# EAGLE design buckler (EAGLE 9.5.2)
AUTHOR: Branden Ghena; REV: B; TITLE: Berkeley Buckler

## Sheet 1 of 3: Headers
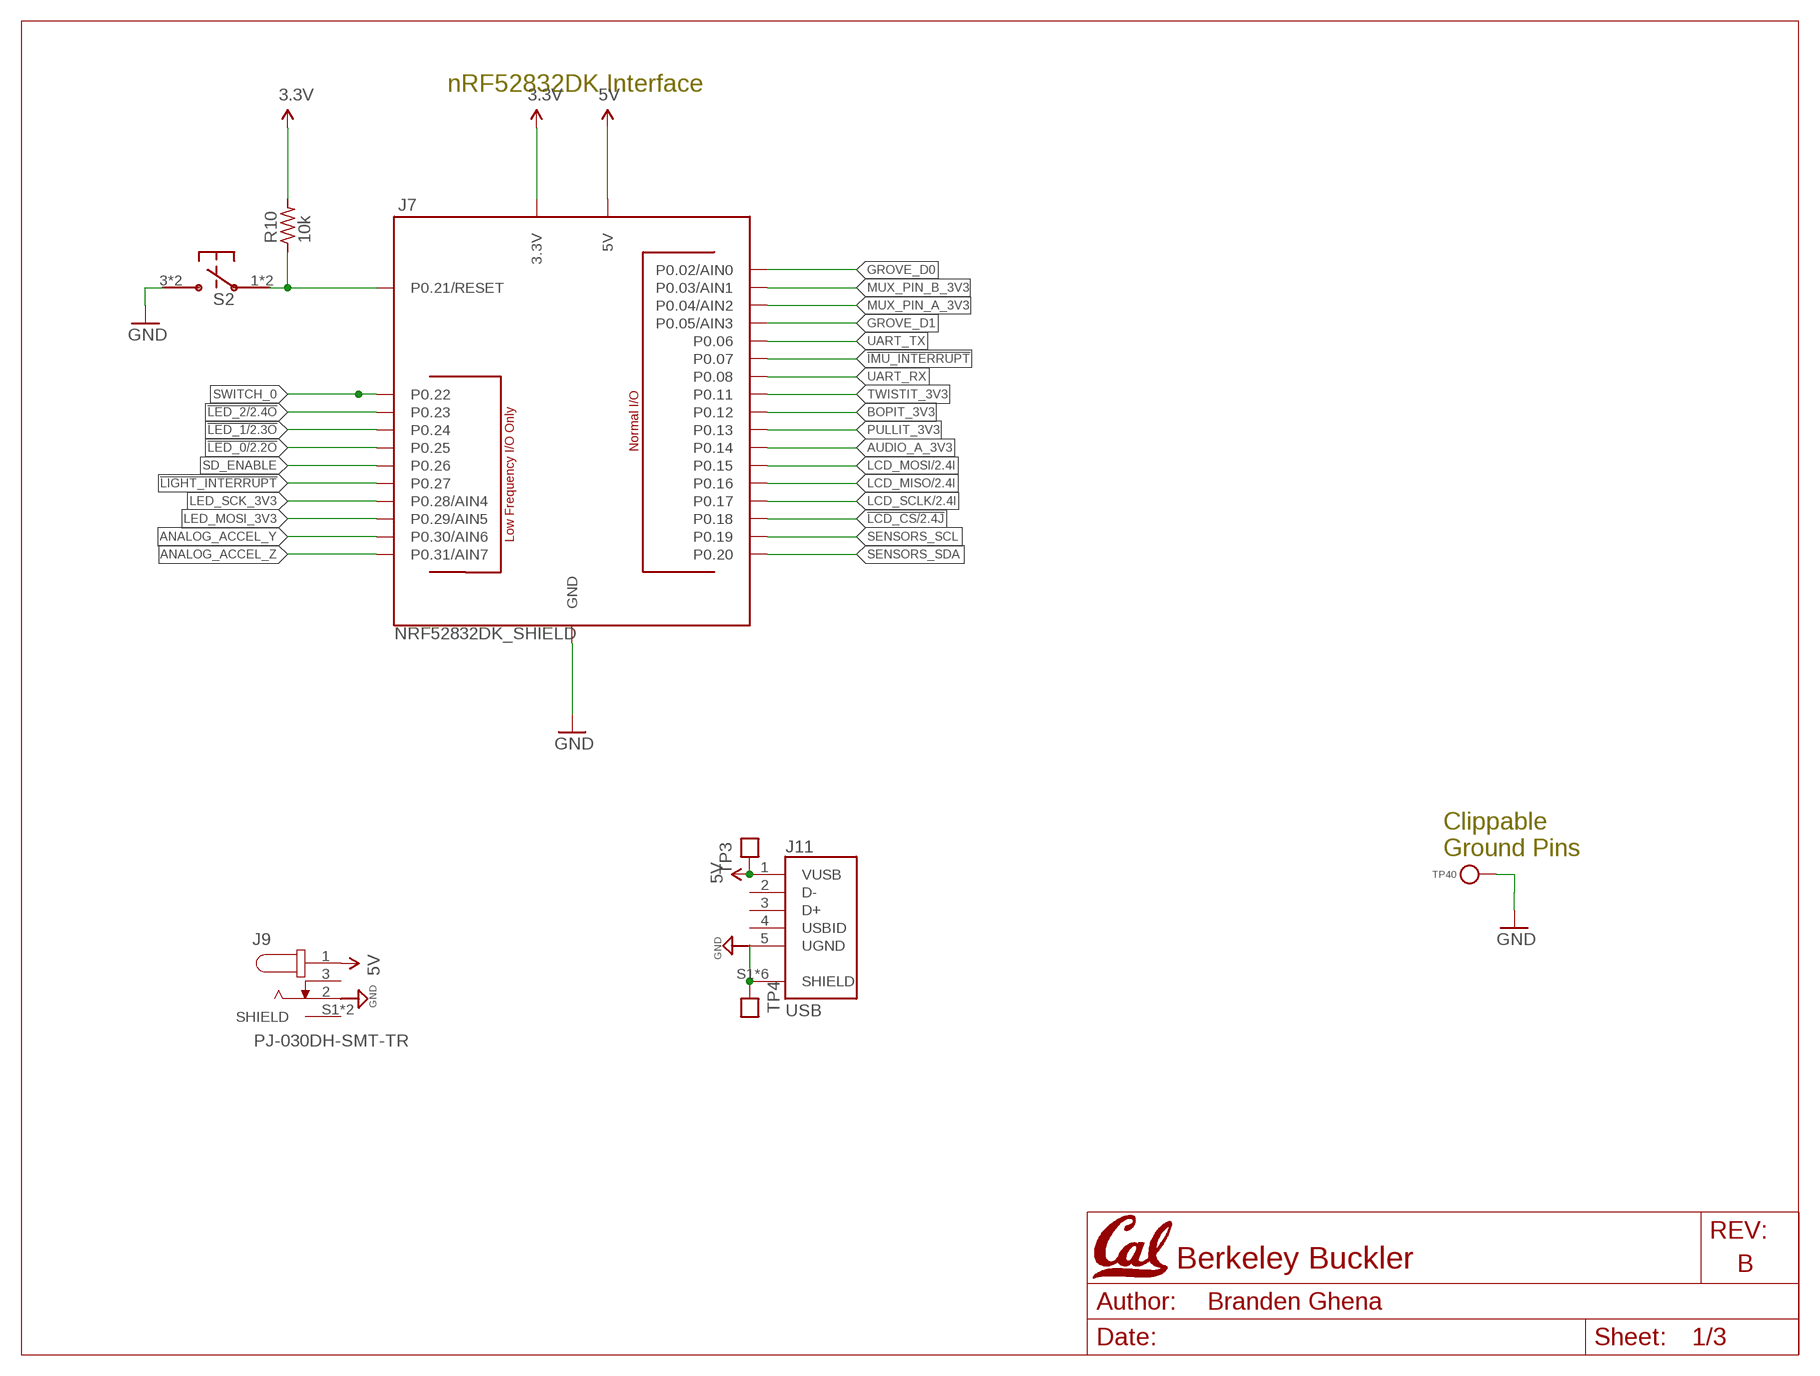
[diagram p0: schematic, sheet 1]
U$1 (LETTER_L_CAL): HEIGHT: 8.5in; WIDTH: 11in

### Parts
J7  NRF52832DK_SHIELD  [NRF52832DK_SHIELD]
J9  PJ-030DH-SMT-TR  [CUI_PJ-030DH-SMT-TR]
J11  USB  [FCI_10103594-0001LF]
R10  10k  R-US_0603  [0603-RES]
S2  PTS645SM43SMTR92  [PTS645]
TP3  TEST_POINTTHRU  [TEST_POINT]
TP4  TEST_POINTTHRU  [TEST_POINT]
TP40  TEST_POINT_0.078IN  [TESTPOINT_0.078IN]

### Nets
3.3V: J7.3.3V@0(3.3V) J7.3.3V@1(3.3V) J7.3.3V@2(3.3V) R10.2 ; also sheet 2,3
5V: J7.5V J9.1 J11.1(VUSB) TP3.1 ; also sheet 2,3
!IMU_INTERRUPT: J7.P0.07
!LCD_CS: J7.P0.18 ; also sheet 2
!LED_0: J7.P0.25 ; also sheet 2
!LED_1: J7.P0.24 ; also sheet 2
!LED_2: J7.P0.23 ; also sheet 2
!LIGHT_INTERRUPT: J7.P0.27
!RESET: J7.P0.21(P0.21/RESET) R10.1 S2.1 S2.2
ANALOG_ACCEL_Y: J7.P0.30(P0.30/AIN6)
ANALOG_ACCEL_Z: J7.P0.31(P0.31/AIN7)
AUDIO_A_3V3: J7.P0.14 ; also sheet 2
BOPIT_3V3: J7.P0.12 ; also sheet 2
GND: J7.GND@0(GND) J7.GND@1(GND) J7.GND@2(GND) J9.2 J11.5(UGND) J11.S1(SHIELD) J11.S2(SHIELD) J11.S3(SHIELD) J11.S4(SHIELD) J11.S5(SHIELD) J11.S6(SHIELD) S2.3 S2.4 TP4.1 TP40.1(TESTPOINT) ; also sheet 2,3
GROVE_D0: J7.P0.02(P0.02/AIN0)
GROVE_D1: J7.P0.05(P0.05/AIN3)
LCD_MISO: J7.P0.16 ; also sheet 2
LCD_MOSI: J7.P0.15 ; also sheet 2
LCD_SCLK: J7.P0.17 ; also sheet 2
LED_MOSI_3V3: J7.P0.29(P0.29/AIN5) ; also sheet 2
LED_SCK_3V3: J7.P0.28(P0.28/AIN4) ; also sheet 2
MUX_PIN_A_3V3: J7.P0.04(P0.04/AIN2) ; also sheet 2
MUX_PIN_B_3V3: J7.P0.03(P0.03/AIN1) ; also sheet 2
PULLIT_3V3: J7.P0.13 ; also sheet 2
SD_ENABLE: J7.P0.26
SENSORS_SCL: J7.P0.19
SENSORS_SDA: J7.P0.20
SWITCH_0: J7.P0.22
TWISTIT_3V3: J7.P0.11 ; also sheet 2
UART_RX: J7.P0.08
UART_TX: J7.P0.06
Unconnected: J9.3 J9.S1(SHIELD) J9.S2(SHIELD) J11.2(D-) J11.3(D+) J11.4(USBID)

### Notes on the sheet
- nRF52832DK Interface
- Clippable
  Ground Pins

## Sheet 2 of 3: Other Peripherals
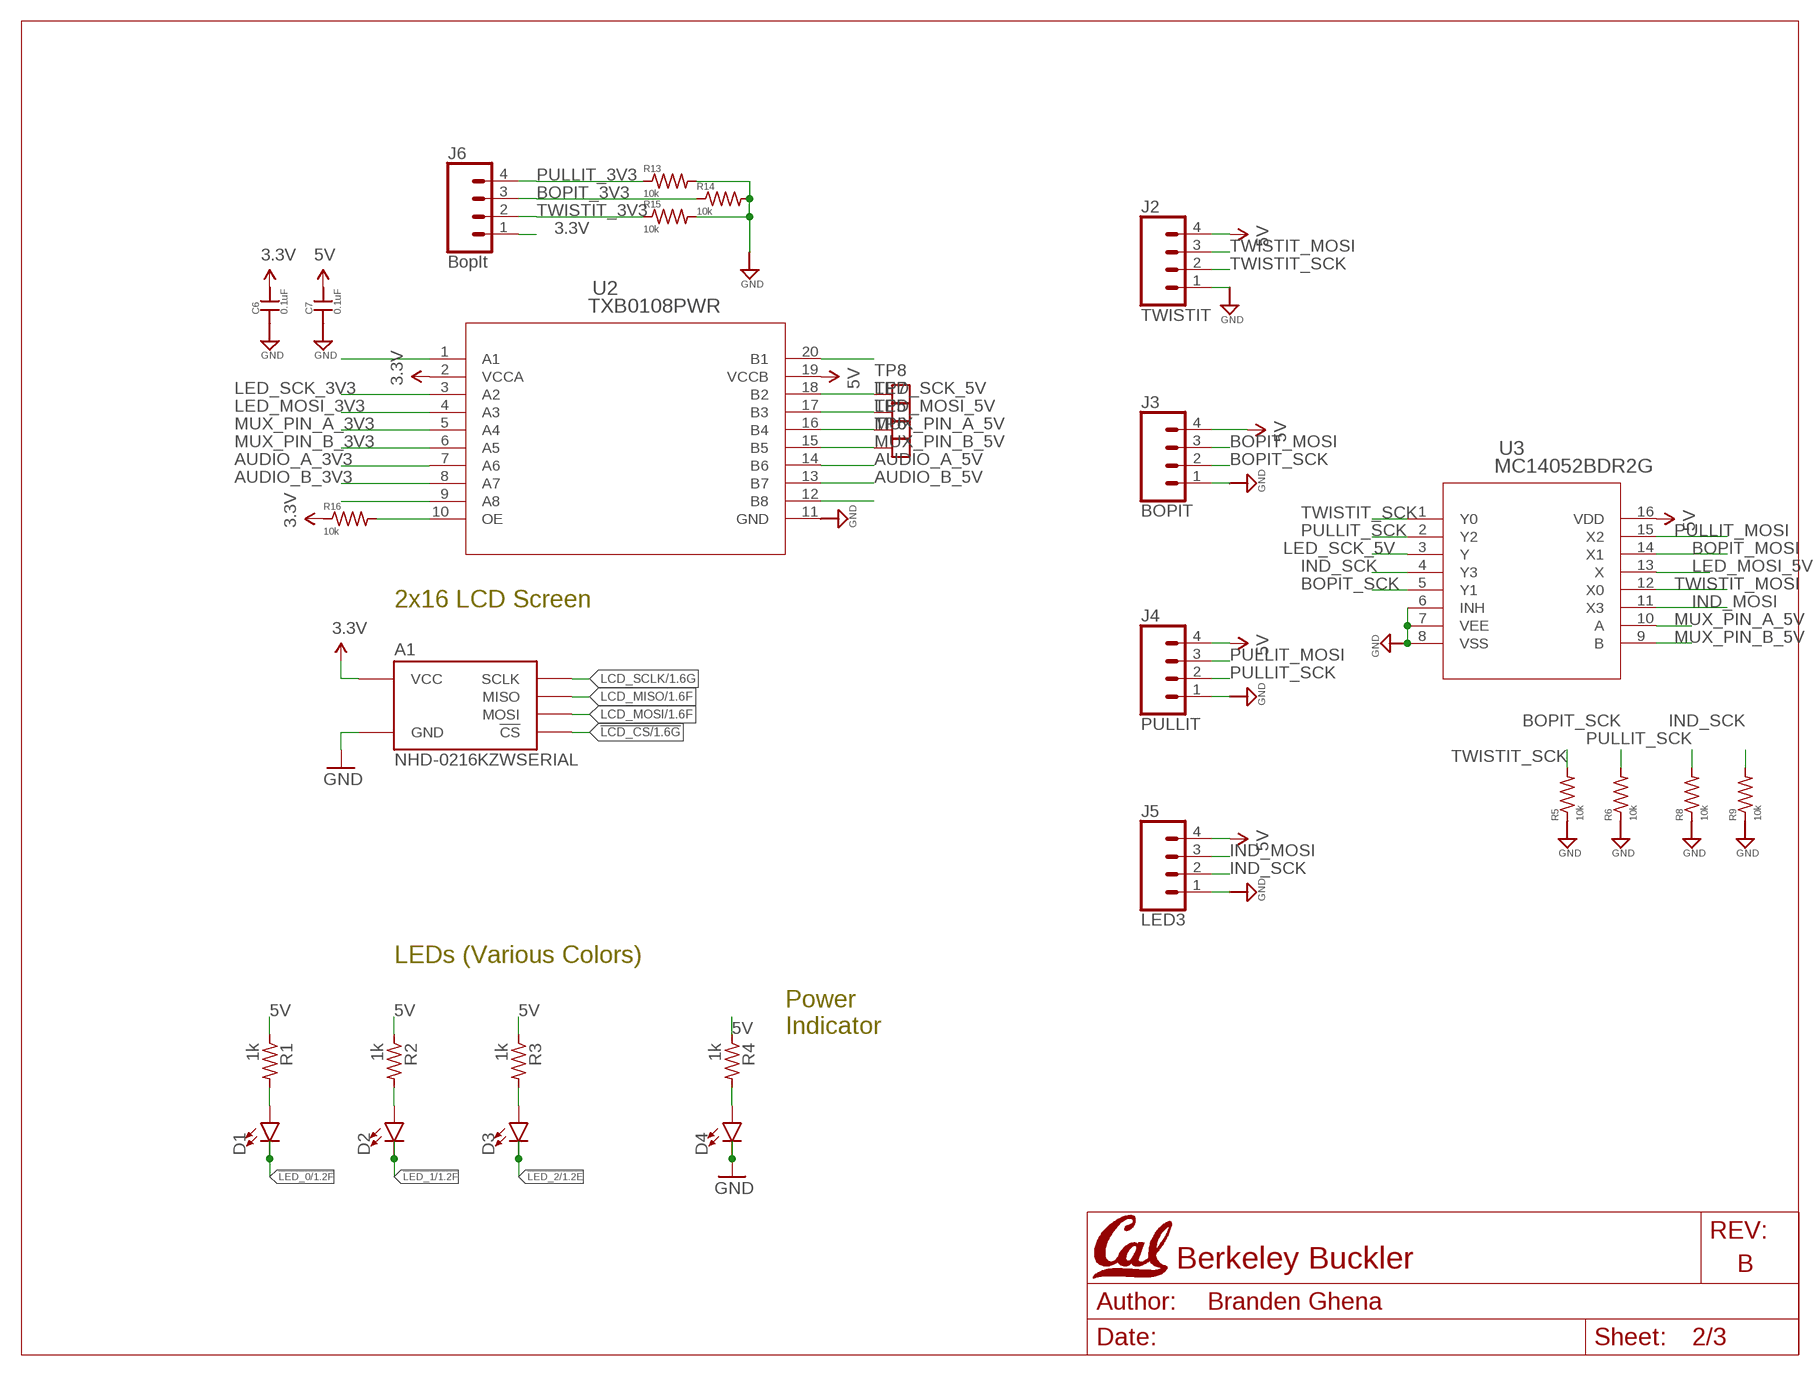
[diagram p1: schematic, sheet 2]
U$3 (LETTER_L_CAL): HEIGHT: 8.5in; WIDTH: 11in

### Parts
A1  NHD-0216KZWSERIAL  [NHD-0216KZW]
C6  0.1uF  CAP0603-CAP  [0603-CAP]
C7  0.1uF  CAP0603-CAP  [0603-CAP]
D1  LED0603  [LED-0603]
D2  LED0603  [LED-0603]
D3  LED0603  [LED-0603]
D4  LED0603  [LED-0603]
J2  TWISTIT  CONN_04POLAR  [MOLEX-1X4]
J3  BOPIT  CONN_04POLAR  [MOLEX-1X4]
J4  PULLIT  CONN_04POLAR  [MOLEX-1X4]
J5  LED3  CONN_04POLAR  [MOLEX-1X4]
J6  BopIt  CONN_04POLAR  [MOLEX-1X4]
R1  1k  R-US_0603  [0603-RES]
R2  1k  R-US_0603  [0603-RES]
R3  1k  R-US_0603  [0603-RES]
R4  1k  R-US_0603  [0603-RES]
R5  10k  R-US_0603  [0603-RES]
R6  10k  R-US_0603  [0603-RES]
R8  10k  R-US_0603  [0603-RES]
R9  10k  R-US_0603  [0603-RES]
R13  10k  R-US_0603  [0603-RES]
R14  10k  R-US_0603  [0603-RES]
R15  10k  R-US_0603  [0603-RES]
R16  10k  R-US_0603  [0603-RES]
TP5  TEST_POINTTHRU  [TEST_POINT]
TP6  TEST_POINTTHRU  [TEST_POINT]
TP7  TEST_POINTTHRU  [TEST_POINT]
TP8  TEST_POINTTHRU  [TEST_POINT]
U2  TXB0108PWR  [PW20]
U3  MC14052BDR2G  [SOIC-16]

### Nets
3.3V: A1.2(VCC) C6.2 J6.1 R16.1 U2.2(VCCA) ; also sheet 1,3
5V: C7.2 J2.4 J3.4 J4.4 J5.4 R1.1 R2.1 R3.1 R4.1 U2.19(VCCB) U3.16(VDD) ; also sheet 1,3
!LCD_CS: A1.16(!CS) ; also sheet 1
!LED_0: D1.C ; also sheet 1
!LED_1: D2.C ; also sheet 1
!LED_2: D3.C ; also sheet 1
AUDIO_A_3V3: U2.7(A6) ; also sheet 1
AUDIO_A_5V: U2.14(B6) ; also sheet 3
AUDIO_B_3V3: U2.8(A7)
AUDIO_B_5V: U2.13(B7) ; also sheet 3
BOPIT_3V3: J6.3 R14.1 ; also sheet 1
BOPIT_MOSI: J3.3 U3.14(X1)
BOPIT_SCK: J3.2 R6.2 U3.5(Y1)
GND: A1.1(GND) C6.1 C7.1 D4.C J2.1 J3.1 J4.1 J5.1 R5.1 R6.1 R8.1 R9.1 R13.2 R14.2 R15.2 U2.11(GND) U3.6(INH) U3.7(VEE) U3.8(VSS) ; also sheet 1,3
IND_MOSI: J5.3 U3.11(X3)
IND_SCK: J5.2 R9.2 U3.4(Y3)
LCD_MISO: A1.13(MISO) ; also sheet 1
LCD_MOSI: A1.14(MOSI) ; also sheet 1
LCD_SCLK: A1.12(SCLK) ; also sheet 1
LED_MOSI_3V3: U2.4(A3) ; also sheet 1
LED_MOSI_5V: TP7.1 U2.17(B3) U3.13(X)
LED_SCK_3V3: U2.3(A2) ; also sheet 1
LED_SCK_5V: TP8.1 U2.18(B2) U3.3(Y)
MUX_PIN_A_3V3: U2.5(A4) ; also sheet 1
MUX_PIN_A_5V: TP5.1 U2.16(B4) U3.10(A)
MUX_PIN_B_3V3: U2.6(A5) ; also sheet 1
MUX_PIN_B_5V: TP6.1 U2.15(B5) U3.9(B)
N$1: R16.2 U2.10(OE)
N$3: D4.A R4.2
N$4: D3.A R3.2
N$5: D2.A R2.2
N$8: U2.20(B1)
N$25: D1.A R1.2
N$28: U2.12(B8)
N$29: U2.9(A8)
N$36: U2.1(A1)
PULLIT_3V3: J6.4 R13.1 ; also sheet 1
PULLIT_MOSI: J4.3 U3.15(X2)
PULLIT_SCK: J4.2 R8.2 U3.2(Y2)
TWISTIT_3V3: J6.2 R15.1 ; also sheet 1
TWISTIT_MOSI: J2.3 U3.12(X0)
TWISTIT_SCK: J2.2 R5.2 U3.1(Y0)

### Notes on the sheet
- 2x16 LCD Screen
- LEDs (Various Colors)
- Power
  Indicator

## Sheet 3 of 3
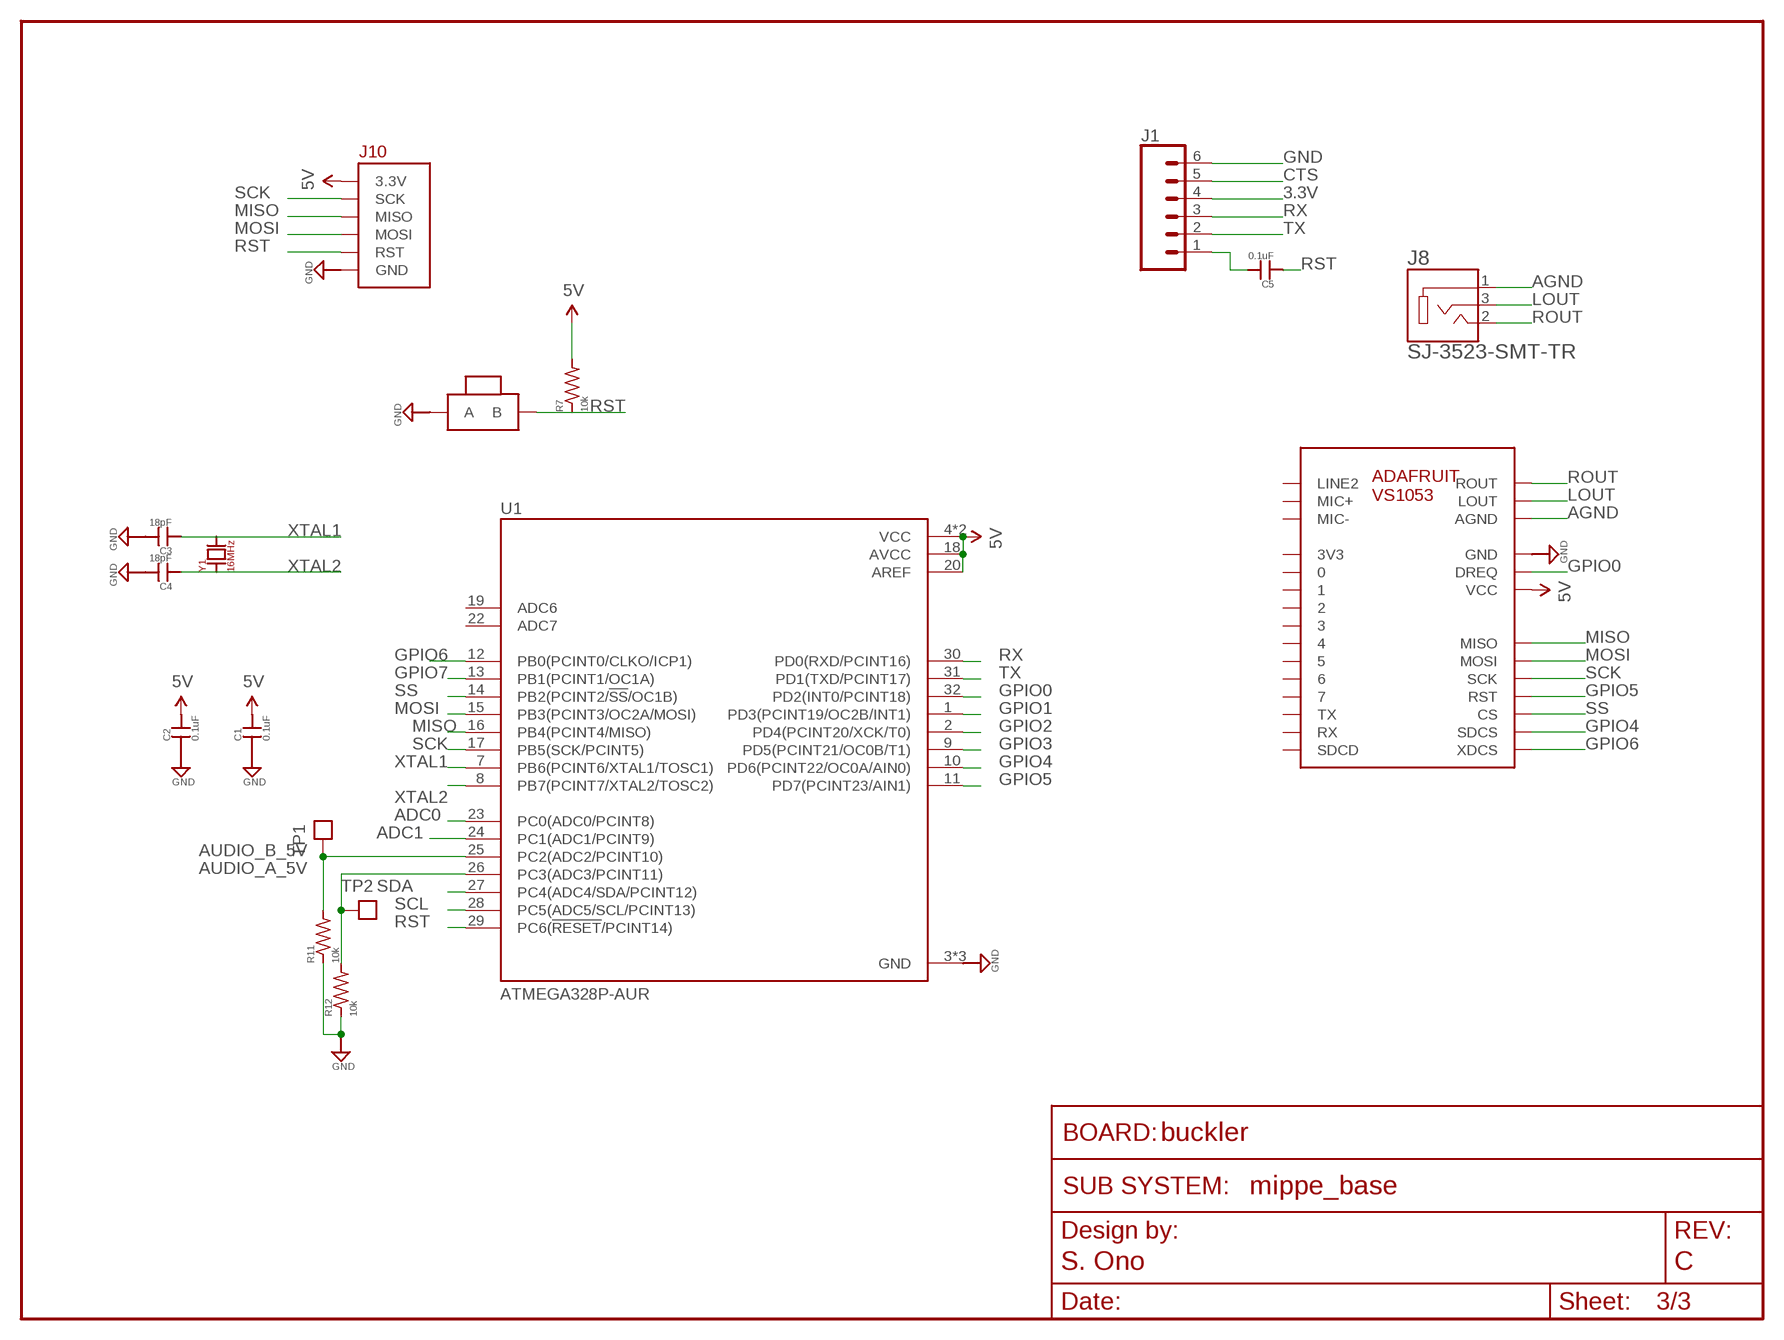
[diagram p2: schematic, sheet 3]
FRAME1 (FRAME_SCHEMATIC): AUTHOR: S. Ono; REV: C; SUBSYSTEM_NAME: mippe_base

### Parts
C1  0.1uF  CAP0603-CAP  [0603-CAP]
C2  0.1uF  CAP0603-CAP  [0603-CAP]
C3  18pF  CAP0603-CAP  [0603-CAP]
C4  18pF  CAP0603-CAP  [0603-CAP]
C5  0.1uF  CAP0603-CAP  [0603-CAP]
J1  CONN_06NO_SILK_FEMALE_PTH  [1X06_NO_SILK]
J8  SJ-3523-SMT-TR  [CUI_SJ-3523-SMT-TR]
J10  BURNIN  [BURNIN]
R7  10k  R-US_R0603  [R0603]
R11  10k  R-US_0603  [0603-RES]
R12  10k  R-US_0603  [0603-RES]
SW1  BTN-PTS810  [BTN_PTS810]
TP1  TEST_POINTTHRU  [TEST_POINT]
TP2  TEST_POINTTHRU  [TEST_POINT]
U1  ATMEGA328P-AUR  [QFP80P900X900X120-32N]
U4  ADAFRUIT_VS1053  [ADAFRUIT_VS1053]
Y1  16MHz  CRYSTAL_SMOL  [XTAL500X320X130N]

### Nets
3.3V: J1.4 ; also sheet 1,2
5V: C1.2 C2.2 J10.3.3V R7.2 U1.4(VCC) U1.6(VCC) U1.18(AVCC) U1.20(AREF) U4.26(VCC) ; also sheet 1,2
ADC0: U1.23(PC0(ADC0/PCINT8))
ADC1: U1.24(PC1(ADC1/PCINT9))
AGND: J8.1 U4.4(AGND) U4.29(AGND) U4.30(AGND)
AUDIO_A_5V: R12.2 TP2.1 U1.26(PC3(ADC3/PCINT11)) ; also sheet 2
AUDIO_B_5V: R11.2 TP1.1 U1.25(PC2(ADC2/PCINT10)) ; also sheet 2
CTS: J1.5
GND: C1.1 C2.1 C3.2 C4.2 J1.6 J10.GND R11.1 R12.1 SW1.1(A) SW1.2(A) U1.3(GND) U1.5(GND) U1.21(GND) U4.24(GND) U4.28(GND) ; also sheet 1,2
GPIO0: U1.32(PD2(INT0/PCINT18)) U4.27(DREQ)
GPIO1: U1.1(PD3(PCINT19/OC2B/INT1))
GPIO2: U1.2(PD4(PCINT20/XCK/T0))
GPIO3: U1.9(PD5(PCINT21/OC0B/T1))
GPIO4: U1.10(PD6(PCINT22/OC0A/AIN0)) U4.18(SDCS)
GPIO5: U1.11(PD7(PCINT23/AIN1)) U4.20(RST)
GPIO6: U1.12(PB0(PCINT0/CLKO/ICP1)) U4.17(XDCS)
GPIO7: U1.13(PB1(PCINT1/OC1A))
LOUT: J8.3 U4.31(LOUT)
MISO: J10.MISO U1.16(PB4(PCINT4/MISO)) U4.23(MISO)
MOSI: J10.MOSI U1.15(PB3(PCINT3/OC2A/MOSI)) U4.22(MOSI)
N$6: C5.2 J1.1
ROUT: J8.2 U4.32(ROUT)
RST: C5.1 J10.RST R7.1 SW1.3(B) SW1.4(B) U1.29(PC6(!RESET!/PCINT14))
RX: J1.3 U1.30(PD0(RXD/PCINT16))
SCK: J10.SCK U1.17(PB5(SCK/PCINT5)) U4.21(SCK)
SCL: U1.28(PC5(ADC5/SCL/PCINT13))
SDA: U1.27(PC4(ADC4/SDA/PCINT12))
SS: U1.14(PB2(PCINT2/!SS!/OC1B)) U4.19(CS)
TX: J1.2 U1.31(PD1(TXD/PCINT17))
XTAL1: C3.1 U1.7(PB6(PCINT6/XTAL1/TOSC1)) Y1.2(B)
XTAL2: C4.1 U1.8(PB7(PCINT7/XTAL2/TOSC2)) Y1.1(A)
Unconnected: U1.19(ADC6) U1.22(ADC7) U4.1(LINE2) U4.2(MIC+) U4.3(MIC-) U4.5(3V3) U4.6 U4.7 U4.8 U4.9 U4.10 U4.11 U4.12 U4.13 U4.14(TX) U4.15(RX) U4.16(SDCD) U4.25(3V3)

## Library data of the parts
A1 = headers:NHD-0216KZW; DIGIKEY: NHD-0216KZW-AG5-ND,952-3305-ND; DIGIKEY1: NHD-0216KZW-AG5-ND; DIGIKEY2: 952-3305-ND; DIGIKEY3: 952-1862-ND
C1-C7 = scono:CAP: Capacitor Standard 0603 ceramic capacitor, and 0.1" leaded capacitor.; PIE-INT-REF-NUM: CAPACITOR-GENERIC
D1-D4 = scono:LED: https://www.digikey.com/products/en/optoelectronics/led-indication-discrete/105?k=&pkeyword=&pv7=2&pv1989=0&pv16=5&FV=ffe00069&quantity=0&ColumnSort=0&page=1&pageSize=25
J1 = scono:CONN_06: Multi connection point. Often used as Generic Header-pin footprint for 0.1 inch spaced/style header connections On any of the 0.1 inch spaced packages, you can populate with these: Break Away Headers - Straight <https://www.sparkfun.com/products/116> (PRT-00116) Break Away Male Headers - Right Angle <https://www.sparkfun.com/products/553> (PRT-00553) Female Headers <https://www.sparkfun.com/products/115> (PRT-00115) Break Away Headers - Machine Pin <https://www.sparkfun.com/products/117> (PRT-00117) Break Away Female Headers - Swiss Machine Pin <https://www.sparkfun.com/products/743> (PRT-00743) Arduino Stackable Header - 6 Pin <https://www.sparkfun.com/products/9280> (PRT-09280) For SCREWTERMINALS and SPRING TERMINALS visit here: Screw Terimnals on SparkFun.com <https://www.sparkfun.com/search/results?term=Screw+Terminals> (5mm/3.5mm/2.54mm spacing) This device is also useful as a general connection point to wire up your design to another part of your project. Our various solder wires solder well into these plated through hole pads. Hook-Up Wire - Assortment (Stranded, 22 AWG) <https://www.sparkfun.com/products/11375> (PRT-11375) Hook-Up Wire - Assortment (Solid Core, 22 AWG) <https://www.sparkfun.com/products/11367> (PRT-11367) View the entire wire category on our website here <https://www.sparkfun.com/categories/141>; PROD_ID: CONN-08437
J2-J6 = scono:CONN_04: Multi connection point. Often used as Generic Header-pin footprint for 0.1 inch spaced/style header connections On any of the 0.1 inch spaced packages, you can populate with these: Break Away Headers - Straight <https://www.sparkfun.com/products/116> (PRT-00116) Break Away Male Headers - Right Angle <https://www.sparkfun.com/products/553> (PRT-00553) Female Headers <https://www.sparkfun.com/products/115> (PRT-00115) Break Away Headers - Machine Pin <https://www.sparkfun.com/products/117> (PRT-00117) Break Away Female Headers - Swiss Machine Pin <https://www.sparkfun.com/products/743> (PRT-00743) For SCREWTERMINALS and SPRING TERMINALS visit here: Screw Terimnals on SparkFun.com <https://www.sparkfun.com/search/results?term=Screw+Terminals> (5mm/3.5mm/2.54mm spacing) This device is also useful as a general connection point to wire up your design to another part of your project. Our various solder wires solder well into these plated through hole pads. Hook-Up Wire - Assortment (Stranded, 22 AWG) <https://www.sparkfun.com/products/11375> (PRT-11375) Hook-Up Wire - Assortment (Solid Core, 22 AWG) <https://www.sparkfun.com/products/11367> (PRT-11367) View the entire wire category on our website here <https://www.sparkfun.com/categories/141> Special notes: Molex polarized connector foot print use with SKU : PRT-08231 with associated crimp pins and housings. 1MM SMD Version SKU: PRT-10208; PROD_ID: CONN-08186; SF_ID: PRT-08231
J7 = headers:NRF52832DK_SHIELD: Shield for the PCA10040 nRF52832 Development Kit; DIGIKEY1: S1011EC-10-ND; DIGIKEY2: S1011EC-08-ND; DIGIKEY3: S1011EC-08-ND; DIGIKEY4: S1011EC-06-ND; DIGIKEY5: S1011EC-09-ND
J8 = scono:SJ-3523-SMT-TR: Audio Jack Connector 3.5 mm Low Profile Surface Mount Stereo Jack, 3 Pin Right-Angle; AVAILABILITY: Unavailable; CUI_PURCHASE_URL: https://www.cuidevices.com/product/interconnect/connectors/audio-connectors/jacks/sj-352x-smt-series?utm_source=snapeda.com&utm_medium=referral&utm_campaign=snapedaBOM; DESCRIPTION: 3.5 mm, Stereo, Right Angle, Surface Mount _SMT_, Audio Jack Connector; MF: CUI Devices; MP: SJ-3523-SMT-TR; PACKAGE: LGA-10 STMicroelectronics; PRICE: None
J9 = scono:PJ-030DH-SMT-TR: Conn Power F 2 POS Solder RA SMD 3 Terminal 1 Port T/R; CUI_PURCHASE_URL: https://www.cui.com/product/interconnect/connectors/dc-power-connectors/jacks/pj-030dh-smt-tr?utm_source=snapeda.com&utm_medium=referral&utm_campaign=snapedaBOM; DESCRIPTION: Conn Power F 2 POS Solder RA SMD 3 Terminal 1 Port T/R; DIGI-KEY_PART_NUMBER: CP-030DHPJ-CT-ND; DIGI-KEY_PURCHASE_URL: https://www.digikey.com/product-detail/en/cui-inc/PJ-030DH-SMT-TR/CP-030DHPJ-CT-ND/3587638?utm_source=snapeda&utm_medium=aggregator&utm_campaign=symbol; MF: CUI Inc.; MP: PJ-030DH-SMT-TR; PACKAGE: None
J10 = scono:BURNIN
J11 = scono:USB: Micro Usb, 2.0 Type b, Receptacle, Smt; DESCRIPTION: Micro Usb, 2.0 Type b, Receptacle, Smt; DIGI-KEY_PART_NUMBER: 609-4050-1-ND; DIGI-KEY_PURCHASE_URL: https://www.digikey.com/product-detail/en/amphenol-icc-fci/10103594-0001LF/609-4050-1-ND/2350357?utm_source=snapeda&utm_medium=aggregator&utm_campaign=symbol; MF: Amphenol ICC; MP: 10103594-0001LF; PACKAGE: None
R1-R4 = scono:R-US_: RESISTOR, American symbol; DESCRIPTION: RES SMD 1K OHM 1% 1/16W 0402; DIGIKEY: RMCF0402FT1K00CT-ND; MANUFACTURER: Stackpole Electronics; MPN: RMCF0402FT1K00
R5 R6 R8 R9 R11-R16 = scono:R-US_: RESISTOR, American symbol
R7 = scono:R-US_: RESISTOR, American symbol; DESCRIPTION: RESISTOR, American symbol; DISTRIBUTOR: DigiKey; MANUFACTURER: Rohm Semiconductor; NOTES: Cut Tape; PACKAGE: R0603
R10 = scono:R-US_: RESISTOR, American symbol; DESCRIPTION: RES SMD 10K OHM 1% 1/16W 0402; DIGIKEY: 1276-3431-1-ND; MANUFACTURER: Samsung Electro-Mechanics; MPN: RC1005F103CS
S2 = switches:PTS645SM43SMTR92: Tactile Switch SPST-NO Top Actuated Surface Mount; DESCRIPTION: SWITCH TACTILE SPST-NO 0.05A 12V; DIGIKEY: CKN9112CT-ND; MANUFACTURER: C&K; MPN: PTS645SM43SMTR92 LFS
SW1 = scono:BTN-PTS810: https://www.digikey.com/product-detail/en/c-k/PTS810-SJM-250-SMTR-LFS/CKN10502CT-ND/4176673
TP1-TP8 = scono:TEST_POINT: 1206 Test point for O-scope probes. For A106146CT-ND or similar
TP40 = headers:TEST_POINT_0.078IN; DESCRIPTION: TERM TURRET SINGLE L=4.75MM TIN; DIGIKEY: 36-1520-2-ND; MANUFACTURER: Keystone Electronics; MPN: 1520-2
U1 = scono:ATMEGA328P-AUR: ATmega328P Series 8 Bit 2 kB RAM 32 kB Flash SMT Microcontroller - TQFP-32; DESCRIPTION: ATmega328P Series 8 Bit 2 kB RAM 32 kB Flash SMT Microcontroller - TQFP-32; DIGI-KEY_PART_NUMBER: ATMEGA328P-AURCT-ND; DIGI-KEY_PURCHASE_URL: https://www.digikey.com/product-detail/en/microchip-technology/ATMEGA328P-AUR/ATMEGA328P-AURCT-ND/3789455?utm_source=snapeda&utm_medium=aggregator&utm_campaign=symbol; MF: Microchip; MP: ATMEGA328P-AUR; PACKAGE: TQFP-32 Microchip
U2 = scono:TXB0108PWR; BUILT_BY: EMA_UL_Team; MANUFACTURER_PART_NUMBER: TXB0108PWR; VENDOR: Texas Instruments
U3 = scono:MC14052BDR2G; COPYRIGHT: Copyright (C) 2016 Accelerated Designs. All rights reserved; MANUFACTURER_PART_NUMBER: MC14052BDR2G; VENDOR: ON Semiconductor
U4 = scono:ADAFRUIT_VS1053
Y1 = scono:CRYSTAL

## Board
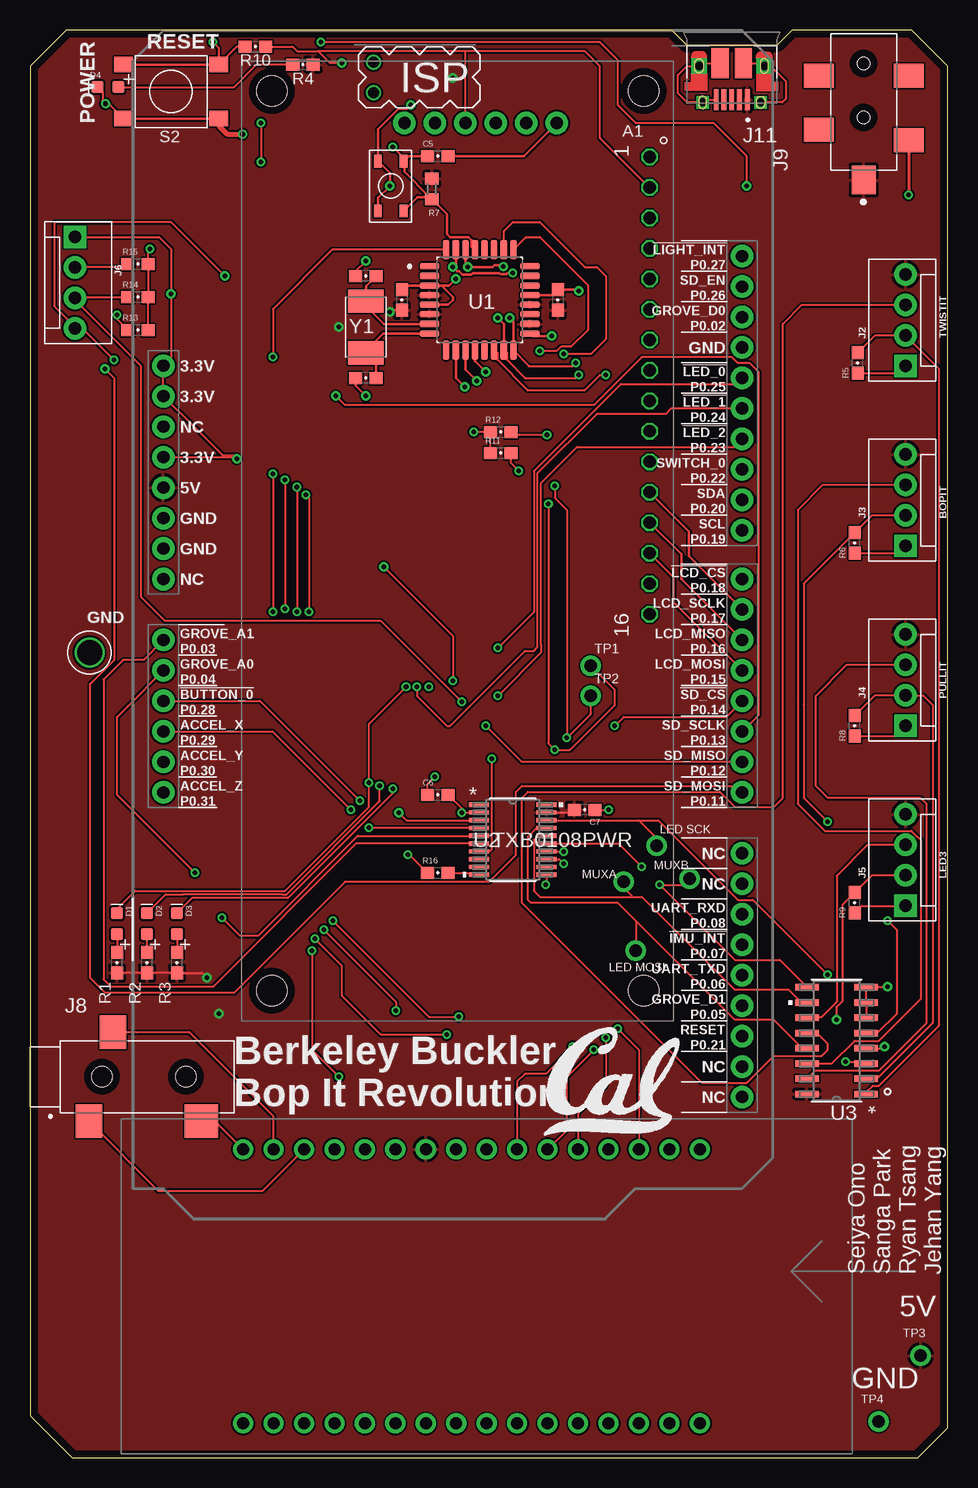
[diagram p3: board, top side]
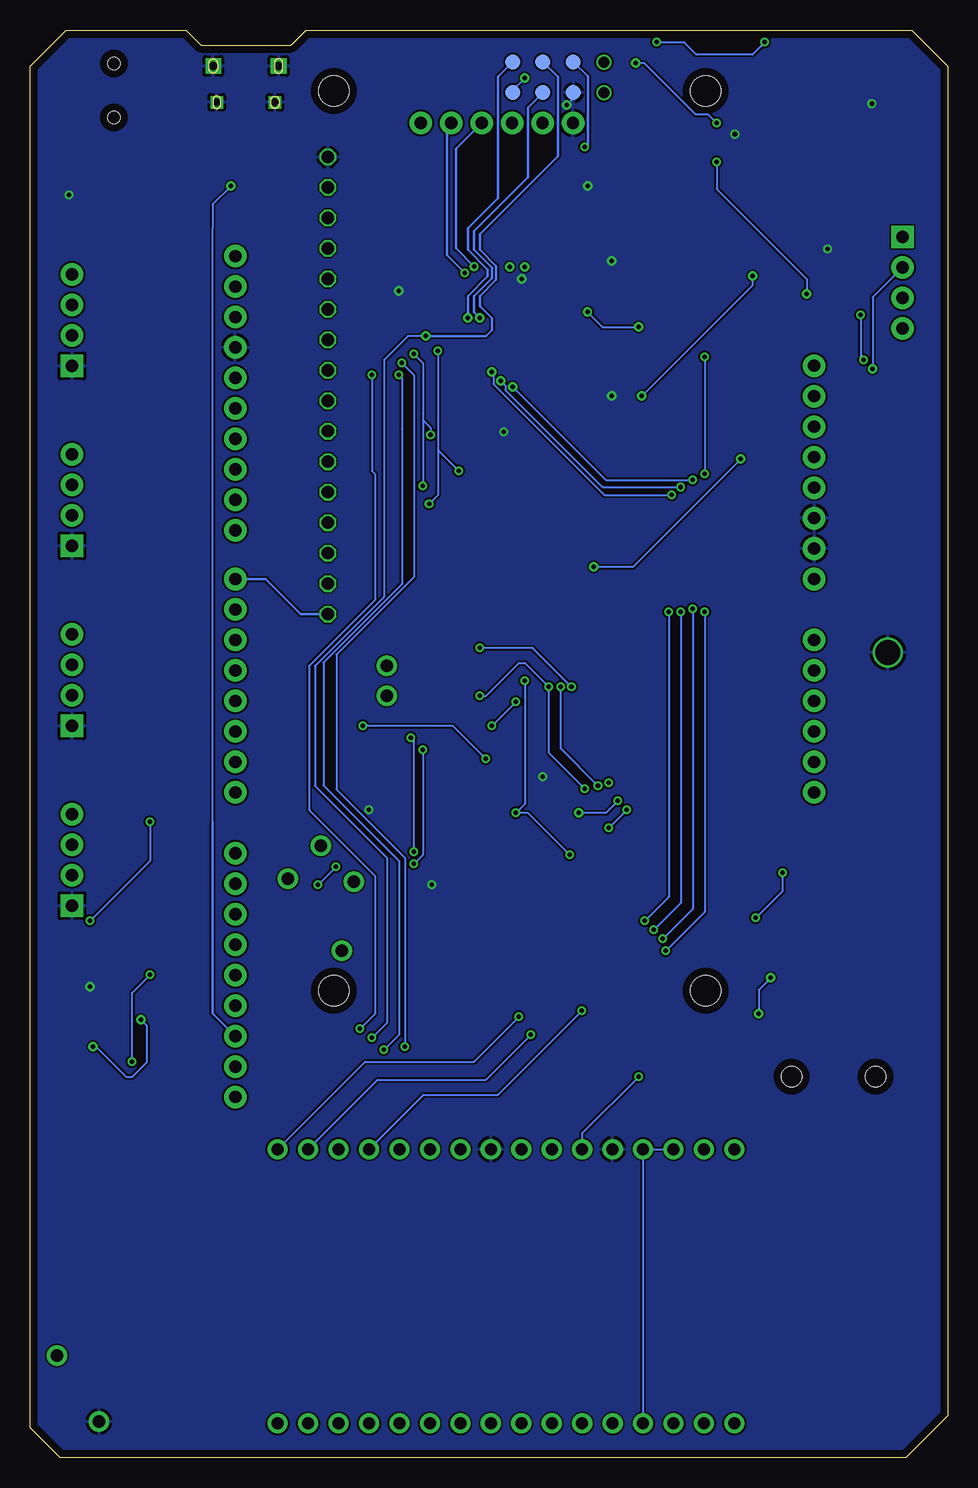
[diagram p4: board, bottom side, seen from below]

Size 76.5 x 119 mm. Coordinates in mm from the lower left corner, seen from the top.
Outline: 76.5,2.5 76.5,116 73.5,119 72.25,119 63.5,119 62.25,117.75 54.75,117.75 53.5,119 53.25,119 3,119 0,116 0,3.5 3.5,0 74,0 76.5,2.5
Copper layers (1*16): Top 2mil / dielectric 9mil / Bottom 2mil
Design rules "scono": minimum track width 6mil, minimum drill 15mil, track to track 6mil, track to pad 6mil, pad to pad 6mil, via to via 6mil, smd to smd 6mil, copper to edge 25mil, drill to drill 7mil, minimum pad ring 7mil, minimum via ring 7mil, stop-mask expansion 3mil, vias tented up to drill 0mil, thermal gap 10mil

### Footprints (pad centres in the part's own frame; a part is rotated, then mirrored left to right if it is on the bottom)
NHD-0216KZW = drill 1.016 octagon: 1 8,-2; 2 10.54,-2; 3 13.08,-2; 4 15.62,-2; 5 18.16,-2; 6 20.7,-2; 7 23.24,-2; 8 25.78,-2; 9 28.32,-2; 10 30.86,-2; 11 33.4,-2; 12 35.94,-2; 13 38.48,-2; 14 41.02,-2; 15 43.56,-2; 16 46.1,-2 | hole 2.5: 2.5,-2.5; 2.5,-33.5; 77.5,-33.5; 77.5,-2.5
0603-CAP = smd 1.1 x 1: 1 -0.85,0; 2 0.85,0
LED-0603 = smd 1 x 1: A 0.877,0; C -0.877,0
1X06_NO_SILK = drill 1.016 pad 1.88: 1 0,0; 2 2.54,0; 3 5.08,0; 4 7.62,0; 5 10.16,0; 6 12.7,0
MOLEX-1X4 = drill 1.016 pad 1.88 square: 1 0,0 | drill 1.016 pad 1.88: 2 2.54,0; 3 5.08,0; 4 7.62,0
NRF52832DK_SHIELD = drill 1.016 pad 1.88: 3.3V@0 0,-7.62; 3.3V@1 0,-2.54; 3.3V@2 0,0; 5V 0,-10.16; !RESET 0,-5.08; GND@0 0,-12.7; GND@1 0,-15.24; GND@2 48.26,1.524; NC@0 0,-17.78; NC@1 48.26,-58.42; NC@2 48.26,-60.96; P0.02 48.26,4.064; P0.03 0,-22.86; P0.04 0,-25.4; P0.05 48.26,-53.34; P0.06 48.26,-50.8; P0.07 48.26,-48.26; P0.08 48.26,-45.72; P0.09 48.26,-43.18; P0.10 48.26,-40.64; P0.11 48.26,-35.56; P0.12 48.26,-33.02; P0.13 48.26,-30.48; P0.14 48.26,-27.94; P0.15 48.26,-25.4; P0.16 48.26,-22.86; P0.17 48.26,-20.32; P0.18 48.26,-17.78; P0.19 48.26,-13.716; P0.20 48.26,-11.176; P0.21 48.26,-55.88; P0.22 48.26,-8.636; P0.23 48.26,-6.096; P0.24 48.26,-3.556; P0.25 48.26,-1.016; P0.26 48.26,6.604; P0.27 48.26,9.144; P0.28 0,-27.94; P0.29 0,-30.48; P0.30 0,-33.02; P0.31 0,-35.56
CUI_SJ-3523-SMT-TR = smd 2.2 x 2.8: 1 -1.1,-3.7; 3 0.9,3.7 | smd 2.8 x 2.8: 2 8.3,-3.7 | hole 1.7: 0,0; 7,0
CUI_PJ-030DH-SMT-TR = smd 2.4 x 2: 1 0,0 | smd 2 x 2.5: 2 3.3,-3.75; 3 4.2,3.75; S1 8.7,3.75; S2 8.7,-3.75 | hole 1: 5.2,0; 9.7,0
BURNIN = smd 1.27 x 1.27 bottom: 3.3V 0,0; GND -5.08,0; MISO 0,2.54; MOSI -2.54,0; RST -5.08,2.54; SCK -2.54,2.54 | drill 0.9: P$7 -7.62,2.54; P$8 -7.62,0
FCI_10103594-0001LF = smd 0.4 x 1.75: 1 -1.3,2.825; 2 -0.65,2.825; 3 0,2.825; 4 0.65,2.825; 5 1.3,2.825 | smd 1.425 x 2.5: S1 -0.963,-0.25; S2 0.963,-0.25 | drill 0.65 pad 1.05 square: S3 -2.425,3.03; S4 2.425,3.03 | drill 0.7 pad 1.3 square: S5 -2.725,0; S6 2.725,0
0603-RES = smd 1.1 x 1: 1 -0.85,0; 2 0.85,0
R0603 = smd 1 x 1.1: 1 -0.85,0; 2 0.85,0
PTS645 = smd 1.55 x 1.3: 1 -3.975,2.25; 2 3.975,2.25; 3 3.975,-2.25; 4 -3.975,-2.25
BTN_PTS810 = smd 1.05 x 0.65: 1 -2.075,1.075; 2 2.075,1.075; 3 -2.075,-1.075; 4 2.075,-1.075
TEST_POINT = drill 1.016 pad 1.676: 1 0,0
TESTPOINT_0.078IN = drill 2.083: 1 0,0
QFP80P900X900X120-32N = smd 1.6 x 0.55: 1 -4.18,2.8; 2 -4.18,2; 3 -4.18,1.2; 4 -4.18,0.4; 5 -4.18,-0.4; 6 -4.18,-1.2; 7 -4.18,-2; 8 -4.18,-2.8; 17 4.18,-2.8; 18 4.18,-2; 19 4.18,-1.2; 20 4.18,-0.4; 21 4.18,0.4; 22 4.18,1.2; 23 4.18,2; 24 4.18,2.8 | smd 0.55 x 1.6: 9 -2.8,-4.18; 10 -2,-4.18; 11 -1.2,-4.18; 12 -0.4,-4.18; 13 0.4,-4.18; 14 1.2,-4.18; 15 2,-4.18; 16 2.8,-4.18; 25 2.8,4.18; 26 2,4.18; 27 1.2,4.18; 28 0.4,4.18; 29 -0.4,4.18; 30 -1.2,4.18; 31 -2,4.18; 32 -2.8,4.18
PW20 = smd 1.676 x 0.356: 1 -2.819,2.925; 2 -2.819,2.275; 3 -2.819,1.625; 4 -2.819,0.975; 5 -2.819,0.325; 6 -2.819,-0.325; 7 -2.819,-0.975; 8 -2.819,-1.625; 9 -2.819,-2.275; 10 -2.819,-2.925; 11 2.819,-2.925; 12 2.819,-2.275; 13 2.819,-1.625; 14 2.819,-0.975; 15 2.819,-0.325; 16 2.819,0.325; 17 2.819,0.975; 18 2.819,1.625; 19 2.819,2.275; 20 2.819,2.925
SOIC-16 = smd 1.956 x 0.533: 1 -2.477,4.445; 2 -2.477,3.175; 3 -2.477,1.905; 4 -2.477,0.635; 5 -2.477,-0.635; 6 -2.477,-1.905; 7 -2.477,-3.175; 8 -2.477,-4.445; 9 2.477,-4.445; 10 2.477,-3.175; 11 2.477,-1.905; 12 2.477,-0.635; 13 2.477,0.635; 14 2.477,1.905; 15 2.477,3.175; 16 2.477,4.445
ADAFRUIT_VS1053 = drill 1 pad 1.676: 1 -10.16,15.24; 2 -10.16,12.7; 3 -10.16,10.16; 4 -10.16,7.62; 5 -10.16,5.08; 6 -10.16,2.54; 7 -10.16,0; 8 -10.16,-2.54; 9 -10.16,-5.08; 10 -10.16,-7.62; 11 -10.16,-10.16; 12 -10.16,-12.7; 13 -10.16,-15.24; 14 -10.16,-17.78; 15 -10.16,-20.32; 16 -10.16,-22.86; 17 12.7,-22.86; 18 12.7,-20.32; 19 12.7,-17.78; 20 12.7,-15.24; 21 12.7,-12.7; 22 12.7,-10.16; 23 12.7,-7.62; 24 12.7,-5.08; 25 12.7,-2.54; 26 12.7,0; 27 12.7,2.54; 28 12.7,5.08; 29 12.7,7.62; 30 12.7,10.16; 31 12.7,12.7; 32 12.7,15.24
XTAL500X320X130N = smd 1.95 x 2.95: 1 -2.15,0; 2 2.15,0

### Placement (x,y rotation side)
A1  53.66,116.41 270 top
C1  31,96.5 270 top
C2  44,96.5 270 top
C3  28,98.5 180 top
C4  28,90 180 top
C5  34,108.5 0 top
C6  34,55.25 0 top
C7  46.25,54 180 top
D1  7.25,44.5 270 top
D2  9.75,44.5 270 top
D3  12.25,44.5 270 top
D4  6.5,114.25 0 top
J1  43.92,111.25 180 top
J2  73,91 90 top
J3  73,76 90 top
J4  73,61 90 top
J5  73,46 90 top
J6  3.75,101.75 270 top
J7  11.12,91.01 0 top
J8  6,31.75 0 top
J9  69.5,106.5 90 top
J10  36.27,113.78 0 top
J11  58.5,116 180 top
R1  7.25,41.25 90 top
R2  9.75,41.25 90 top
R3  12.25,41.25 90 top
R4  22.76,116.12 180 top
R5  69,91.25 90 top
R6  68.75,76.25 90 top
R7  33.5,105.75 90 top
R8  68.75,61 90 top
R9  68.75,46.25 90 top
R10  18.8,117.62 0 top
R11  39.25,83.75 0 top
R12  39.25,85.5 0 top
R13  9,94 0 top
R14  9,96.75 0 top
R15  9,99.5 0 top
R16  34,48.75 0 top
S2  11.76,113.87 0 top
SW1  30.08,105.99 90 top
TP1  46.75,66 0 top
TP2  46.75,63.5 0 top
TP3  74.25,8.5 0 top
TP4  70.75,3 0 top
TP5  49.5,48 0 top
TP6  55,48.25 0 top
TP7  50.5,42.25 0 top
TP8  52.25,51 0 top
TP40  4.96,67.1 0 top
U1  37.5,96.5 0 top
U2  40.25,51.5 0 top
U3  67.25,34.75 180 top
U4  33,13 90 top
U$5  [UCB_CAL_350MIL]  42.87,26.88 0 top
Y1  28,94.25 90 top

### Tracks (layer width: path | path; a pad name or v marks a point on that pad's centre or on a via)
3.3V  (via drill 0.38, 0.39, 0.4)
  Top 0.152: 36.25,117.25 46.25,117.25 47.5,116 47.5,110.03 47.5,110 47.53,110 A1.2 | 36.25,117.25 24,117.25 | 24,117.25 22.25,117.25 21.88,117.62 R10.2 | v19.25,111.25 19.25,111 v19.25,108 | 36.25,117.25 36.25,111.25 J1.4 | J7.3.3V@0 16.11,83.39 | U2.2 36.02,53.77 v36,53.75 36,54.1 C6.2 | v26,116.25 25,116.25 24,117.25 | 16.05,83.55 13.54,86.05 J7.3.3V@1 J7.3.3V@2 11.12,91.12 11.75,91.75 v11.75,97 11.75,100.75 10.75,101.75 J6.1 | 16.05,83.55 16.11,83.48 16.11,83.39 | 16.11,83.39 17.11,83.39 | 17.11,83.39 v17.25,83.25 | v29.5,74.25 35.25,68.5 v35.25,64.75 | 16.05,83.55 16.95,83.55 17.11,83.39 | R16.1 31.65,50.25 v31.5,50.25
  Bottom 0.152: v19.25,108 19.25,105.75 11.75,98.25 v11.75,97 | v35.25,64.75 35.25,54.5 v36,53.75 35,53.75 v31.5,50.25 | v19.25,111.25 19.95,111.95 20.98,111.95 25.28,116.25 v26,116.25 | v17.25,83.25 26.25,74.25 v29.5,74.25
5V  (via drill 0.4)
  Top 0.152: R1.1 R2.1 R3.1 14.35,40.4 v14.75,40 | C1.2 30.16,95.65 v30,95.5 | U2.19 45.17,53.77 C7.2
  Bottom 0.152: J10.3.3V 36.27,113.98 v35.25,115 | v14.75,40 15.75,39 v15.75,37 | v30,95.5 28.75,94.25 v25.75,94.25
  pour Top: -3.49,115.78 4.77,124.03 72.08,124.03 78.43,117.68 78.43,2.05 73.98,-2.39 -0.95,-2.39 -3.49,0.15
!LCD_CS
  Bottom 0.203: J7.P0.18 56.84,73.23 53.92,70.31 A1.16
!LED_0  (via drill 0.39)
  Top 0.152: 59.5,89.99 59.01,89.5 49.25,89.5 42,82.25 42,70.5 v39,67.5 | v31.35,64.25 28.25,61.15 v28.25,56.25 28.25,54.25 21.25,47.25 8.75,47.25 7.25,45.75 D1.C
  Top 0.203: 59.5,89.99 J7.P0.25
  Bottom 0.152: v31.35,64.25 34.6,67.5 v39,67.5
!LED_1  (via drill 0.39)
  Top 0.152: J7.P0.24 53.45,87.45 53,87 47.25,87 42.3,82.06 42.3,67.56 42,67.25 41.25,67.25 35,61 34.75,61 32.25,63.5 v32.25,64.25 | v29.15,56 29.15,54.72 21.38,46.95 21,46.95 12.75,46.95 11.32,46.95 D2.C
  Bottom 0.152: v29.15,56 32.25,59.1 v32.25,64.25
!LED_2  (via drill 0.39)
  Top 0.152: J7.P0.23 58.72,84.25 45.61,84.25 42.61,81.25 42.61,67.75 42.61,67.11 v39,63.5 | v30.25,55.75 30.25,55.39 21.5,46.64 13.51,46.64 D3.C
  Bottom 0.152: v30.25,55.75 33.25,58.75 v33.25,64.25 35.25,66.25 35.75,66.25 38.5,63.5 v39,63.5
!RESET  (via drill 0.38, 0.4)
  Top 0.152: v59.75,106 59.75,108.5 57,111.25 50.5,111.25 49,112.75 49,116.5 47.5,118 v24.25,118 | R10.1 17.23,117.62 15.8,116.19 | v15.25,118 15.73,117.52 S2.2
  Top 0.203: S2.1 S2.2 15.8,116.19
  Bottom 0.152: 61.28,52.91 61.28,102.47 61.28,104.47 v59.75,106 | v24.25,118 22,118 21,117 16.25,117 v15.25,118
  Bottom 0.203: J7.P0.21 61.28,37.03 61.28,52.91
AGND
  Top 0.152: J8.1 10.7,22.25 19.39,22.25 U4.30
  Bottom 0.152: U4.30 U4.29 U4.4
AUDIO_A_3V3  (via drill 0.39)
  Top 0.152: U2.7 38.27,50.52 38.5,50.75 v38.5,58.25 | J7.P0.14 58.06,61.75 49.5,61.75 v48.75,61
  Bottom 0.152: v38.5,58.25 41.25,61 v48.75,61
AUDIO_A_5V  (via drill 0.39)
  Top 0.152: U1.26 39.5,102.25 40.25,103 42.5,103 43.38,102.12 46.25,99.25 47.25,99.25 48,98.5 48,93.25 46.75,92 v44.5,92 | v43.75,81 43.75,80 44.75,79 v44.75,60 46.75,62 TP2.1 | v43.1,85.25 40.35,85.25 R12.2 | U2.14 44.48,50.52 v44.5,50.5
  Bottom 0.152: v44.5,92 43.75,91.25 43.75,87 43.75,86.5 | 43.75,86.5 v43.75,81 | 43.75,86.5 43.1,85.85 v43.1,85.25 | v44.5,50.5 44.5,59.75 v44.75,60
AUDIO_B_5V  (via drill 0.39)
  Top 0.152: U1.25 41.37,101.75 42.5,101.75 46.5,97.75 46.5,94 45.1,92.6 44.25,92.6 43.9,92.25 v42.5,92.25 | v43.21,79.5 43.21,59.54 v43.75,59 45,59 48.75,62.75 48.75,64 TP1.1 | v40.75,82.25 40.1,82.9 R11.2 | U2.13 44.12,49.88 v44.5,49.5
  Bottom 0.152: v42.5,92.25 42.5,86.25 | 42.5,86.25 42.5,80.21 v43.21,79.5 | 42.5,86.25 42.5,84 v40.75,82.25 | v43.75,59 43.75,50.25 v44.5,49.5
BOPIT_3V3  (via drill 0.38)
  Top 0.152: J7.P0.12 41.01,57.99 v38,61 | R14.1 3.83,96.75 J6.3 3.75,96.5 9.25,91 9.25,71.75 11.25,69.75 29.25,69.75 v36,63
  Bottom 0.152: v38,61 v36,63
BOPIT_MOSI
  Top 0.152: J3.3 66.08,81.08 64,79 64,63 64,54.5 66.25,52.25 73.48,52.25 73.98,51.75 74,51.75 74.25,51.5 74.25,38.25 70.75,34.75 68.75,34.75 66.84,32.84 U3.14
BOPIT_SCK  (via drill 0.38)
  Top 0.152: J3.2 70.19,78.54 R6.2 64.5,72.85 64.5,62.75 64.5,55 v66.5,53 | U3.5 70.64,35.39 72.25,37 72.25,44 v71.5,44.75
  Bottom 0.152: v71.5,44.75 66.5,49.75 v66.5,53
GND  (via drill 0.38, 0.39, 0.4)
  Top 0.152: R9.1 69.35,46 J5.1 | R8.1 72.15,60.15 J4.1 | R6.1 72.4,75.4 J3.1 | R5.1 72.4,90.4 J2.1 | v71.5,39.25 69.78,39.25 U3.8 U3.7 U3.6 | U2.11 43.07,47.82 v43,47.75 | R11.1 R12.1 v37,85.5 | R13.2 9.85,96.5 | 9.85,96.5 R14.2 | 9.85,96.5 R15.2 9.85,100.6 v10,100.75 | J11.S2 56.02,116.25 J11.S6 54.75,116 54,115.25 54,113.75 54.78,112.97 J11.S4 56.28,113.17 J11.5 | J11.S1 60.98,116.25 J11.S5 61.75,116 63,114.75 63,113.25 62.72,112.97 J11.S3 | C6.1 33.15,56.15 v33.75,56.75 | C7.1 v48.25,54 | D4.C 6.05,113.82 6.05,113.1
  Top 0.2: C3.2 27.15,98.9 v28,99.75 | C4.2 27.15,89.35 v28,88.5 | C1.1 31.35,97.7 U1.3 | U1.5 34.85,96.1 35.25,96.5 35.25,96.75 34.3,97.7 U1.3 | U1.3 34.95,97.7 v35.5,98.25 | U1.21 43.55,96.9 C2.1 45.65,97.35 v45.75,97.25 | v31.75,112.75 31.44,112.44 30.73,112.44 29,110.72 SW1.2 30,107.07 v30,106 29,105 SW1.1
  Top 0.203: S2.3 S2.4 6.55,112.85 v6.29,112.85 6.05,113.1
  Top 0.256: J9.2 v73.25,105.25
  Top 0.406: v17.72,110.31 16.45,110.31 15.73,111.04 S2.3
  Bottom 0.2: J10.GND 31.19,113.31 v31.75,112.75
  pour Bottom: -1.58,121.49 85,121.49 88.56,117.93 88.56,6.5 80.94,-1.12 3.5,-1.12 -4.12,6.5 -4.12,118.95
GPIO0  (via drill 0.39)
  Top 0.152: U1.32 25.18,100.68 20.25,95.75 v20.25,91.75 | v20.25,82 v20.25,70.5 | v23.5,42.25 23.5,34 v25.75,31.75
  Bottom 0.152: v20.25,91.75 v20.25,82 | v20.25,70.5 20.25,45.5 v23.5,42.25 | v25.75,31.75 30.46,27.04 U4.27
GPIO4  (via drill 0.39, 0.4)
  Top 0.152: v21.25,81.5 v21.25,70.75 | v34.75,35.25 29.25,35.25 26,38.5 26,41 v23.75,43.25
  Top 0.2: v36.25,89.25 35.5,90 U1.10
  Bottom 0.152: v36.25,89.25 28.5,81.5 v21.25,81.5 | v21.25,70.75 21.25,45.75 v23.75,43.25 | U4.18 47.52,31.5 38.5,31.5 v34.75,35.25
GPIO5  (via drill 0.39, 0.4)
  Top 0.152: v22.25,80.9 v22.25,70.5 | v24.5,44 30.5,38 v30.5,37.25
  Top 0.2: U1.11 36.3,90.7 v37.25,89.75
  Bottom 0.152: v37.25,89.75 36.86,89.36 36.86,89 28.76,80.9 v22.25,80.9 | v22.25,70.5 22.25,46.25 v24.5,44 | U4.20 43.69,30.25 37.5,30.25 v30.5,37.25
GPIO6  (via drill 0.39, 0.4)
  Top 0.152: v23,80.25 23.25,80 v23.25,70.5 | v25.25,44.75 33.25,36.75 v35.75,36.75
  Top 0.2: v38,90.5 37.1,91.4 U1.12
  Bottom 0.152: v38,90.5 37.86,90.36 37.86,89.5 28.61,80.25 v23,80.25 | v23.25,70.5 23.25,46.75 v25.25,44.75 | U4.17 48.56,33 39.5,33 v35.75,36.75
IND_MOSI
  Top 0.152: J5.3 69.83,51.08 67.25,48.5 67.25,43 67.25,38 66,36.75 64.87,36.75 U3.11
IND_SCK  (via drill 0.4)
  Top 0.152: J5.2 70.19,48.54 R9.2 67.75,46.1 67.75,38.07 67.25,37.57 v67.25,36.5 | U3.4 71.11,34.11 v71.25,34.25
  Bottom 0.152: v71.25,34.25 71,34.25 68.5,31.75 68,31.75 66.75,33 66.75,36 v67.25,36.5
LCD_MISO
  Top 0.203: A1.13 54.3,75.3 54.3,73.23 J7.P0.16
LCD_MOSI
  Top 0.203: J7.P0.15 53.66,71.33 53.66,73.39 A1.14
LCD_SCLK
  Top 0.203: A1.12 54.94,77.2 54.94,75.14 J7.P0.17
LED_MOSI_3V3  (via drill 0.38)
  Top 0.152: U2.4 28.27,52.48 v28.25,52.5 | J7.P0.29 20.22,60.53 v26.75,54
  Bottom 0.152: v26.75,54 v28.25,52.5
LED_MOSI_5V
  Top 0.152: 50,45.25 58.75,36.5 62,36.5 64.38,34.11 U3.13 | 50,45.25 49,46.25 41.75,46.25 41.5,46.5 41.5,51.75 42.23,52.48 U2.17 | 50,45.25 50.5,44.75 TP7.1
LED_SCK_3V3  (via drill 0.38, 0.4)
  Top 0.152: v30.75,53.75 31.25,53.25 | 31.25,53.25 31.38,53.12 | 31.25,53.25 31.38,53.12 | 31.38,53.12 U2.3 | J7.P0.28 19.18,63.07 v27.5,54.75
  Bottom 0.152: v27.5,54.75 28.5,53.75 v30.75,53.75
LED_SCK_5V  (via drill 0.38)
  Top 0.152: v66.5,40.25 60.25,46.5 59,46.5 53.25,52.25 52.38,53.12 50.75,53.12 | v68,33 69.57,33 U3.3 | U2.18 50.75,53.12 | 50.75,53.12 52.25,51.62 TP8.1
  Bottom 0.152: v66.5,40.25 68,38.75 v68,33
LOUT
  Top 0.152: U4.31 20.3,28.45 13.3,35.45 J8.3
MISO  (via drill 0.39, 0.4)
  Top 0.152: v45.5,91.25 45.25,91 41.62,91 | v45.25,34.25 43,32 41.25,32 40.62,31.37 U4.23
  Top 0.2: 41.62,91 U1.16 40.3,94.7 v40,95
  Bottom 0.152: v45.5,91.25 44.5,90.25 44.5,73.39 50.94,66.94 50.94,55.69 45.25,50 v45.25,34.25
  Bottom 0.2: J10.MISO 37.5,115.09 37.5,110 37.5,105 40,102.5 40,100.68 38.34,99.02 38.34,98.48 40,96.82 v40,95
MOSI  (via drill 0.39, 0.4)
  Top 0.152: v45.75,90.25 45.5,90 41.27,90 | U4.22 44.75,27.29 44.75,31.75 v47,34
  Top 0.2: 41.27,90 39.77,91.5 39.77,92.05 U1.15 39.5,94.5 v39,95
  Bottom 0.152: v45.75,90.25 45.5,90 45.5,85.75 45.5,72.82 52.03,66.28 52.03,56.03 45.75,49.75 45.75,35.25 v47,34
  Bottom 0.2: J10.MOSI 35,112.51 35,106.75 39.5,102.25 39.5,100.68 37.99,99.17 37.99,98.33 39.5,96.82 39.5,95.5 v39,95
MUX_PIN_A_3V3  (via drill 0.38)
  Top 0.152: U2.5 27.32,51.83 19,43.5 17.5,43.5 v16,45 | J7.P0.04 8.13,62.62 7.25,61.74 7.25,55.25 v13.75,48.75
  Bottom 0.152: v16,45 13.75,47.25 v13.75,48.75
MUX_PIN_A_5V
  Top 0.152: U2.16 42.33,51.83 42,51.5 42,47.25 42.5,46.75 50.25,46.75 | U3.10 64.33,37.92 63.25,39 58.75,39 51,46.75 50.25,46.75 | 50.25,46.75 49.5,47.5 TP5.1
MUX_PIN_B_3V3
  Top 0.152: U2.6 27.18,51.17 15.25,39.25 6.75,39.25 6.12,39.88 6.12,64.88 7.75,66.5 9.47,66.5 J7.P0.03
MUX_PIN_B_5V  (via drill 0.38)
  Top 0.152: U3.9 64.77,39.23 62.5,41.5 58.75,41.5 v52.5,47.75 54.5,47.75 TP6.1 | U2.15 49.08,51.17 v51,49.25
  Bottom 0.152: v52.5,47.75 v51,49.25
N$1
  Top 0.152: R16.2 37.26,48.75 U2.10
N$3
  Top 0.152: R4.2 18.87,116.12 17,114.25 D4.A
N$4
  Top 0.152: D3.A R3.2
N$5
  Top 0.152: R2.2 D2.A
N$6
  Top 0.2: J1.1 41.17,108.5 C5.2
N$25
  Top 0.152: D1.A R1.2
PULLIT_3V3  (via drill 0.39, 0.4)
  Top 0.152: J7.P0.13 60.75,61.9 60.75,90.5 60,91.25 59,91.25 58.5,91.75 51,91.75 47,87.75 26.25,87.75 v25.5,88.5 | v16.25,98.5 11.75,103 10,103 2,103 2,96 3.75,94.25 J6.4 4.37,94.13 v7,91.5 | R13.1 7.25,94.9 v7.25,95.25
  Bottom 0.152: v25.5,88.5 16.25,97.75 v16.25,98.5 | v7.25,95.25 7.25,91.75 v7,91.5
PULLIT_MOSI
  Top 0.152: J4.3 68.08,66.08 65.5,63.5 65.5,56 66.5,55 74.25,55 74.75,54.5 74.75,36.25 70.75,32.25 65.45,32.25 U3.15
PULLIT_SCK
  Top 0.152: R8.2 70.44,63.54 J4.2 74.46,63.54 75.25,62.75 75.25,36.25 70.75,31.75 69.9,31.75 U3.2
ROUT
  Top 0.152: J8.2 15.41,28.05 U4.32
RST  (via drill 0.38)
  Top 0.2: 31.22,108.13 SW1.4 31.59,108.5 C5.1 | U1.29 36.83,100.95 36.83,101.5 36.58,101.75 35,101.75 34.75,102 34.75,103.65 R7.1 33.33,105.08 | 33.33,105.08 31.22,107.18 31.22,108.13 | SW1.3 32.31,105.08 33.33,105.08 | v30.25,109.25 31.22,108.28 31.22,108.13
  Bottom 0.2: J10.RST 30,115.13 30,109.5 v30.25,109.25
RX  (via drill 0.38, 0.4)
  Top 0.2: U1.30 36.3,99.45 v36.5,99.25 38.57,99.25 38.73,99.41 39.25,99.41 | 39.25,99.41 39.34,99.41 | 39.25,99.41 39.34,99.41 | 39.34,99.41 v39.48,99.28
  Bottom 0.2: v39.48,99.28 41,100.8 41,103.5 41,109.09 J1.3
SCK  (via drill 0.39, 0.4)
  Top 0.152: v48,35 48,31 45.7,28.7 U4.21
  Top 0.2: v43.5,93.5 41.88,93.5 U1.17
  Bottom 0.152: v43.5,93.5 45,93.5 47,91.5 47,71.75 52.75,66 52.75,56 46.75,50 46.75,36.25 v48,35
  Bottom 0.2: J10.SCK 32.5,115.09 32.5,108.5 39,102 39,100.67 37.64,99.31 37.64,98.19 39,96.83 39,96 38,95 38,94 38.5,93.5 v43.5,93.5
SS  (via drill 0.39)
  Top 0.152: 41.47,89 46.25,89 47.5,90.25 v48,90.25 | v49,35.75 50.78,33.97 U4.19
  Top 0.2: U1.14 38.97,92.05 38.97,91.5 41.47,89
  Bottom 0.152: v48,90.25 48,82.25 47.75,82 47.75,71.5 53.25,66 53.25,54 47.75,48.5 47.75,37 v49,35.75
TWISTIT_3V3  (via drill 0.4)
  Top 0.152: J7.P0.11 58.83,56 41,56 40.5,55.5 40.5,50.25 38.25,48 26.25,48 17,38.75 6.25,38.75 5,40 5,64.5 7,66.5 7,90 v6.25,90.75 | R15.1 7.86,99.21 J6.2
  Bottom 0.152: J6.2 6.25,96.71 v6.25,90.75
TWISTIT_MOSI
  Top 0.152: J2.3 64.33,96.08 62.75,94.5 62.75,55 62,54.25 58.75,54.25 57.5,55.5 41.5,55.5 41,55 41,46.25 56,31.25 59.75,31.25 62,33.5 66,33.5 66.5,34 66.5,34.5 65.62,35.39 U3.12
TWISTIT_SCK
  Top 0.152: R5.2 70.44,93.54 J2.2 75.75,90.79 75.75,36 70.75,31 70.25,31 69.73,30.48 U3.1
TX  (via drill 0.38, 0.4)
  Top 0.2: U1.31 35.5,99.5 v35.25,99.25 35.59,98.91 35.77,98.91 36.08,98.59 36.77,98.59 36.93,98.75 39.12,98.75 39.22,98.65 39.73,98.65 39.83,98.75 v40.25,98.75
  Bottom 0.2: v40.25,98.75 41.75,100.25 41.75,110.88 J1.2
XTAL1
  Top 0.2: C3.1 28,97.65 Y1.2 28,96 29.5,94.5 U1.7
XTAL2
  Top 0.2: C4.1 28.85,91.25 Y1.1 28,92.25 29.45,93.7 U1.8

### Text on the board
tPlace: RESET | POWER | !LIGHT_INT | SD_EN | GROVE_D0 | !LED_0 | !LED_1 | !LED_2 | SWITCH_0 | SDA | SCL | !LCD_CS | LCD_SCLK | GND | LCD_MISO | GROVE_A1 | LCD_MOSI | GROVE_A0 | !SD_CS | !BUTTON_0 | ACCEL_X | SD_SCLK | SD_MISO | ACCEL_Y | ACCEL_Z | SD_MOSI | LED SCK | MUXB | MUXA | !IMU_INT | LED MOSI | GROVE_D1 | Berkeley Buckler / Bop It Revolution | Seiya Ono / Sanga Park / Ryan Tsang / Jehan Yang | 5V | GND